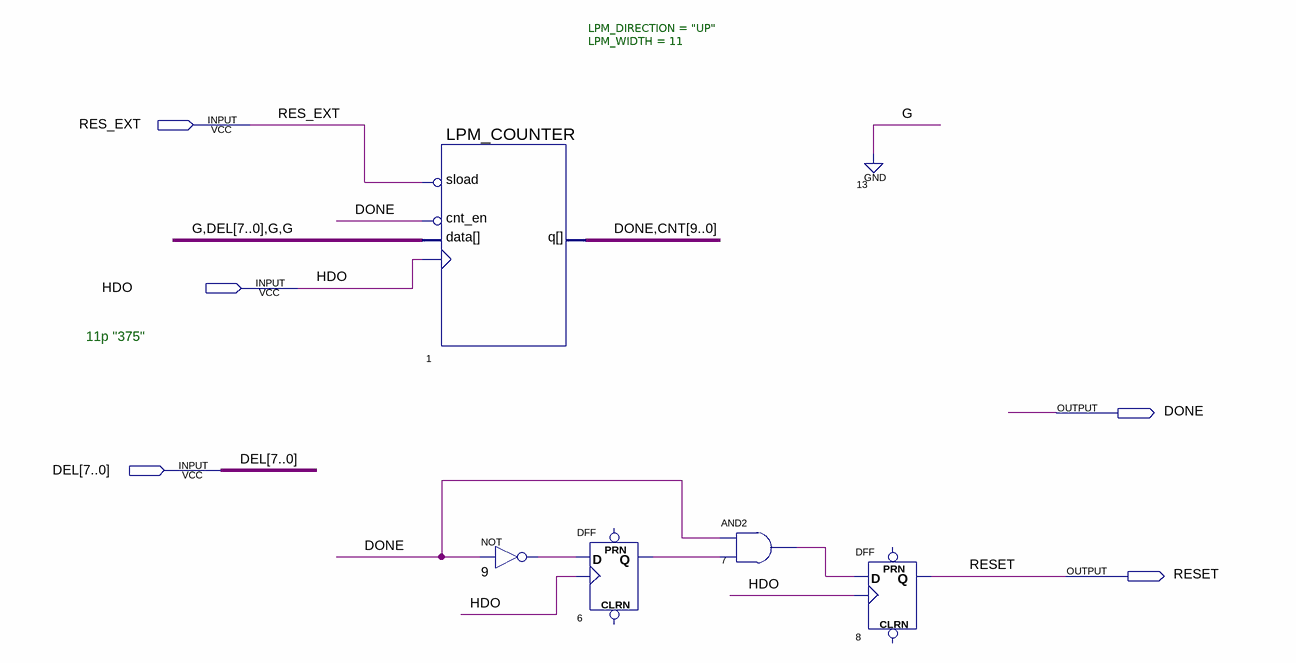
[diagram p0: schematic sheet]
// Quartus schematic reset_sender.bdf as structural Verilog: 5 symbols, 5 pins
module reset_sender (
  input  RES_EXT,
  input  HDO,
  input  [7:0] DEL,
  output DONE,
  output RESET
);

  wire n6_q, n7_out, n9_out;
  wire [9:0] CNT;

  LPM_COUNTER #(.LPM_DIRECTION("UP"), .LPM_WIDTH(11)) u_1 (
    .sload(~RES_EXT), .cnt_en(~DONE), .data({1'b0, DEL, 2'b00}), .clock(HDO), .q({DONE, CNT}));
  not u_9 (n9_out, DONE);
  DFF u_6 (.CLK(HDO), .D(n9_out), .Q(n6_q));  // open: CLRN, PRN
  and u_7 (n7_out, DONE, n6_q);
  DFF u_8 (.CLK(HDO), .D(n7_out), .Q(RESET));  // open: CLRN, PRN

  // Notes on the sheet:
  //   11p "375"
endmodule
